# Altium schematic sheet Z7_MGTX.SchDoc
size A3
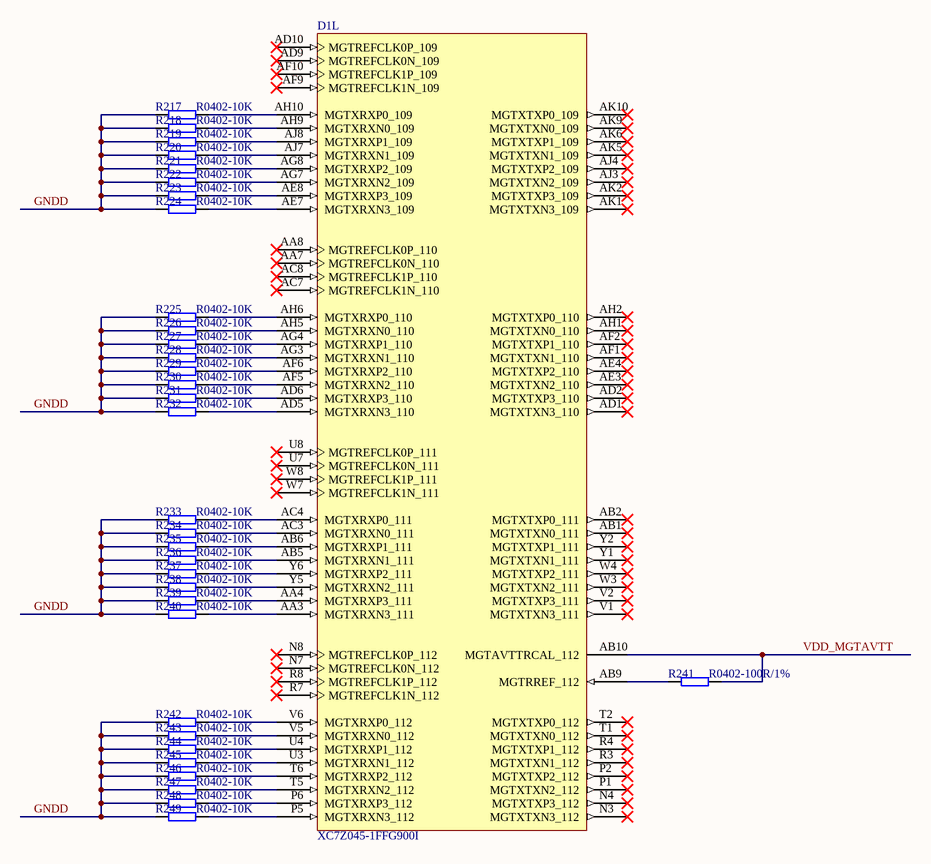
[diagram p0: Z7_MGTX.SchDoc]

## Parts
D1  XC7Z045-1FFG900I  [FFG900]  (part L of 16)
R217  R0402-10K  [R0402]
R218  R0402-10K  [R0402]
R219  R0402-10K  [R0402]
R220  R0402-10K  [R0402]
R221  R0402-10K  [R0402]
R222  R0402-10K  [R0402]
R223  R0402-10K  [R0402]
R224  R0402-10K  [R0402]
R225  R0402-10K  [R0402]
R226  R0402-10K  [R0402]
R227  R0402-10K  [R0402]
R228  R0402-10K  [R0402]
R229  R0402-10K  [R0402]
R230  R0402-10K  [R0402]
R231  R0402-10K  [R0402]
R232  R0402-10K  [R0402]
R233  R0402-10K  [R0402]
R234  R0402-10K  [R0402]
R235  R0402-10K  [R0402]
R236  R0402-10K  [R0402]
R237  R0402-10K  [R0402]
R238  R0402-10K  [R0402]
R239  R0402-10K  [R0402]
R240  R0402-10K  [R0402]
R241  R0402-100R/1%  [R0402]
R242  R0402-10K  [R0402]
R243  R0402-10K  [R0402]
R244  R0402-10K  [R0402]
R245  R0402-10K  [R0402]
R246  R0402-10K  [R0402]
R247  R0402-10K  [R0402]
R248  R0402-10K  [R0402]
R249  R0402-10K  [R0402]

## Nets
GNDD: R217.2 R218.2 R219.2 R220.2 R221.2 R222.2 R223.2 R224.2 R225.2 R226.2 R227.2 R228.2 R229.2 R230.2 R231.2 R232.2 R233.2 R234.2 R235.2 R236.2 R237.2 R238.2 R239.2 R240.2 R242.2 R243.2 R244.2 R245.2 R246.2 R247.2 R248.2 R249.2
VDD_MGTAVTT: D1.AB10(MGTAVTTRCAL_112) R241.1
NetD1_AA3: D1.AA3(MGTXRXN3_111) R240.1
NetD1_AA4: D1.AA4(MGTXRXP3_111) R239.1
NetD1_AB5: D1.AB5(MGTXRXN1_111) R236.1
NetD1_AB6: D1.AB6(MGTXRXP1_111) R235.1
NetD1_AB9: D1.AB9(MGTRREF_112) R241.2
NetD1_AC3: D1.AC3(MGTXRXN0_111) R234.1
NetD1_AC4: D1.AC4(MGTXRXP0_111) R233.1
NetD1_AD5: D1.AD5(MGTXRXN3_110) R232.1
NetD1_AD6: D1.AD6(MGTXRXP3_110) R231.1
NetD1_AE7: D1.AE7(MGTXRXN3_109) R224.1
NetD1_AE8: D1.AE8(MGTXRXP3_109) R223.1
NetD1_AF5: D1.AF5(MGTXRXN2_110) R230.1
NetD1_AF6: D1.AF6(MGTXRXP2_110) R229.1
NetD1_AG3: D1.AG3(MGTXRXN1_110) R228.1
NetD1_AG4: D1.AG4(MGTXRXP1_110) R227.1
NetD1_AG7: D1.AG7(MGTXRXN2_109) R222.1
NetD1_AG8: D1.AG8(MGTXRXP2_109) R221.1
NetD1_AH5: D1.AH5(MGTXRXN0_110) R226.1
NetD1_AH6: D1.AH6(MGTXRXP0_110) R225.1
NetD1_AH9: D1.AH9(MGTXRXN0_109) R218.1
NetD1_AH10: D1.AH10(MGTXRXP0_109) R217.1
NetD1_AJ7: D1.AJ7(MGTXRXN1_109) R220.1
NetD1_AJ8: D1.AJ8(MGTXRXP1_109) R219.1
NetD1_P5: D1.P5(MGTXRXN3_112) R249.1
NetD1_P6: D1.P6(MGTXRXP3_112) R248.1
NetD1_T5: D1.T5(MGTXRXN2_112) R247.1
NetD1_T6: D1.T6(MGTXRXP2_112) R246.1
NetD1_U3: D1.U3(MGTXRXN1_112) R245.1
NetD1_U4: D1.U4(MGTXRXP1_112) R244.1
NetD1_V5: D1.V5(MGTXRXN0_112) R243.1
NetD1_V6: D1.V6(MGTXRXP0_112) R242.1
NetD1_Y5: D1.Y5(MGTXRXN2_111) R238.1
NetD1_Y6: D1.Y6(MGTXRXP2_111) R237.1

Not connected (* = marked no-connect by the designer): D1 AA7(MGTREFCLK0N_110)* AA8(MGTREFCLK0P_110)* AB1(MGTXTXN0_111)* AB2(MGTXTXP0_111)* AC7(MGTREFCLK1N_110)* AC8(MGTREFCLK1P_110)* AD1(MGTXTXN3_110)* AD2(MGTXTXP3_110)* AD9(MGTREFCLK0N_109)* AD10(MGTREFCLK0P_109)* AE3(MGTXTXN2_110)* AE4(MGTXTXP2_110)* AF1(MGTXTXN1_110)* AF2(MGTXTXP1_110)* AF9(MGTREFCLK1N_109)* AF10(MGTREFCLK1P_109)* AH1(MGTXTXN0_110)* AH2(MGTXTXP0_110)* AJ3(MGTXTXN2_109)* AJ4(MGTXTXP2_109)* AK1(MGTXTXN3_109)* AK2(MGTXTXP3_109)* AK5(MGTXTXN1_109)* AK6(MGTXTXP1_109)* AK9(MGTXTXN0_109)* AK10(MGTXTXP0_109)* N3(MGTXTXN3_112)* N4(MGTXTXP3_112)* N7(MGTREFCLK0N_112)* N8(MGTREFCLK0P_112)* P1(MGTXTXN2_112)* P2(MGTXTXP2_112)* R3(MGTXTXN1_112)* R4(MGTXTXP1_112)* R7(MGTREFCLK1N_112)* R8(MGTREFCLK1P_112)* T1(MGTXTXN0_112)* T2(MGTXTXP0_112)* U7(MGTREFCLK0N_111)* U8(MGTREFCLK0P_111)* V1(MGTXTXN3_111)* V2(MGTXTXP3_111)* W3(MGTXTXN2_111)* W4(MGTXTXP2_111)* W7(MGTREFCLK1N_111)* W8(MGTREFCLK1P_111)* Y1(MGTXTXN1_111)* Y2(MGTXTXP1_111)*

## Library data of the parts
D1 = XC7Z045-1FFG900I: 667 MHz Zynq?7000 AP SoC, 130 PS I/O, 378 FPGA I/O, 900-Ball BGA, Speed Grade 1, Industrial Grade, Pb-Free; Manufacturer: Xilinx; Extensible Block RAM (# 36Kb Blocks): 2180 KB (545); Flip Flops: 437200; LUTs: 218600; Speed Grade: -1; DatasheetVersion: v1.2; PackageVersion: Rev 1.1; PackageReference: FFG900; PackageDescription: Flip-Chip BGA, Body 31 x 31 mm, 1.0 mm Pitch; Generic Part Number: XC7Z045; RoHS: Pb-Free; Mounting Technology: Surface Mount; Code_JEDEC: MS-034-AAN-1; PartNumber: XC7Z045-1FFG900I; ComponentLink1Description: Datasheet; ComponentLink1URL: http://www.xilinx.com/support/documentation/data_sheets/ds190-Zynq-7000-Overview.pdf; ComponentLink2Description: Package Specification; ComponentLink2URL: http://www.xilinx.com/support/documentation/user_guides/ug865-Zynq-7000-Pkg-Pinout.pdf; ComponentLink3Description: DC and AC Switching Characteristics; ComponentLink3URL: http://www.xilinx.com/support/documentation/data_sheets/ds191-XC7Z030-XC7Z045-data-sheet.pdf; ComponentLink4Description: Package File; ComponentLink4URL: http://www.xilinx.com/support/packagefiles/z7packages/xc7z045ffg900pkg.txt; ComponentLink5Description: Packaging and Pinout; ComponentLink5URL: http://www.xilinx.com/support/documentation/user_guides/ug865-Zynq-7000-Pkg-Pinout.pdf; ComponentLink6Description: PCB and Layout Guide; ComponentLink6URL: http://www.xilinx.com/support/documentation/user_guides/ug483_7Series_PCB.pdf
R217-R249 = R0402-10K: Manufacturer: SAMSUNG; Part_type: RES; Schematic_Part: RES; PCB_Footprint: R0402
  R217-R240 R242-R249: Part_number: R0402-10K; Value: R0402-10K
  R241: Part_number: R0402-100R/1%; Value: R0402-100R/1%